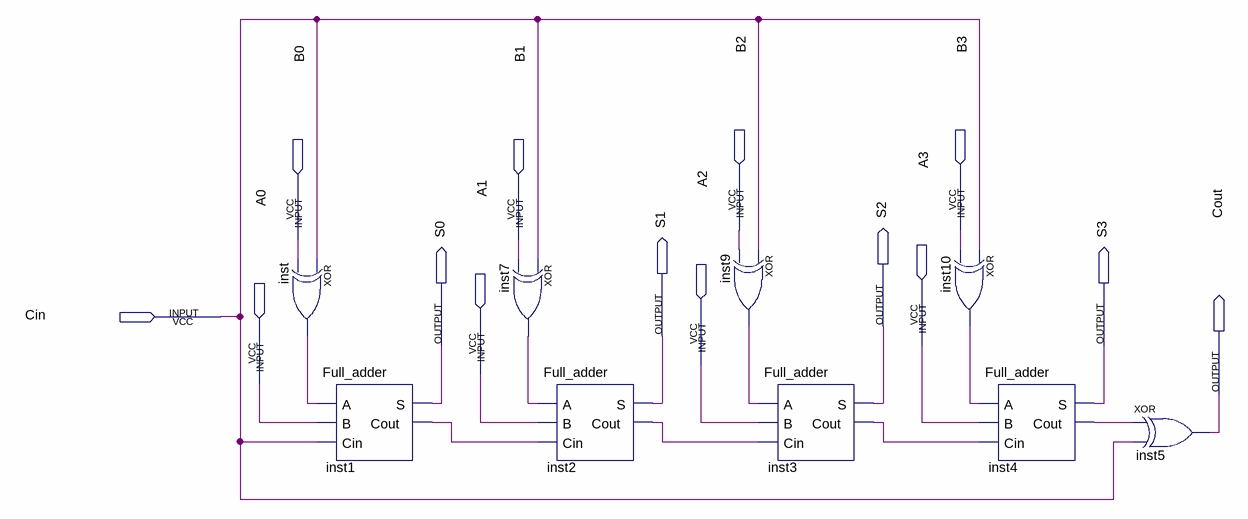
[diagram p0: schematic sheet]
// Quartus schematic Question2alt.bdf as structural Verilog: 9 symbols, 14 pins
module Question2alt (
  input  B2,
  input  B3,
  input  B0,
  input  B1,
  input  Cin,
  input  A3,
  input  A2,
  input  A1,
  input  A0,
  output S2,
  output S1,
  output S0,
  output S3,
  output Cout
);

  wire inst1_cout, inst2_cout, inst3_cout, inst4_cout, inst7_out, inst9_out, inst10_out, inst_out;

  xor inst (inst_out, Cin, B0);
  Full_adder inst1 (.A(inst_out), .B(A0), .Cin(Cin), .S(S0), .Cout(inst1_cout));
  xor inst7 (inst7_out, Cin, B1);
  Full_adder inst2 (.A(inst7_out), .B(A1), .Cin(inst1_cout), .S(S1), .Cout(inst2_cout));
  xor inst9 (inst9_out, Cin, B2);
  Full_adder inst3 (.A(inst9_out), .B(A2), .Cin(inst2_cout), .S(S2), .Cout(inst3_cout));
  xor inst10 (inst10_out, Cin, B3);
  Full_adder inst4 (.A(inst10_out), .B(A3), .Cin(inst3_cout), .S(S3), .Cout(inst4_cout));
  xor inst5 (Cout, inst4_cout, Cin);
endmodule
